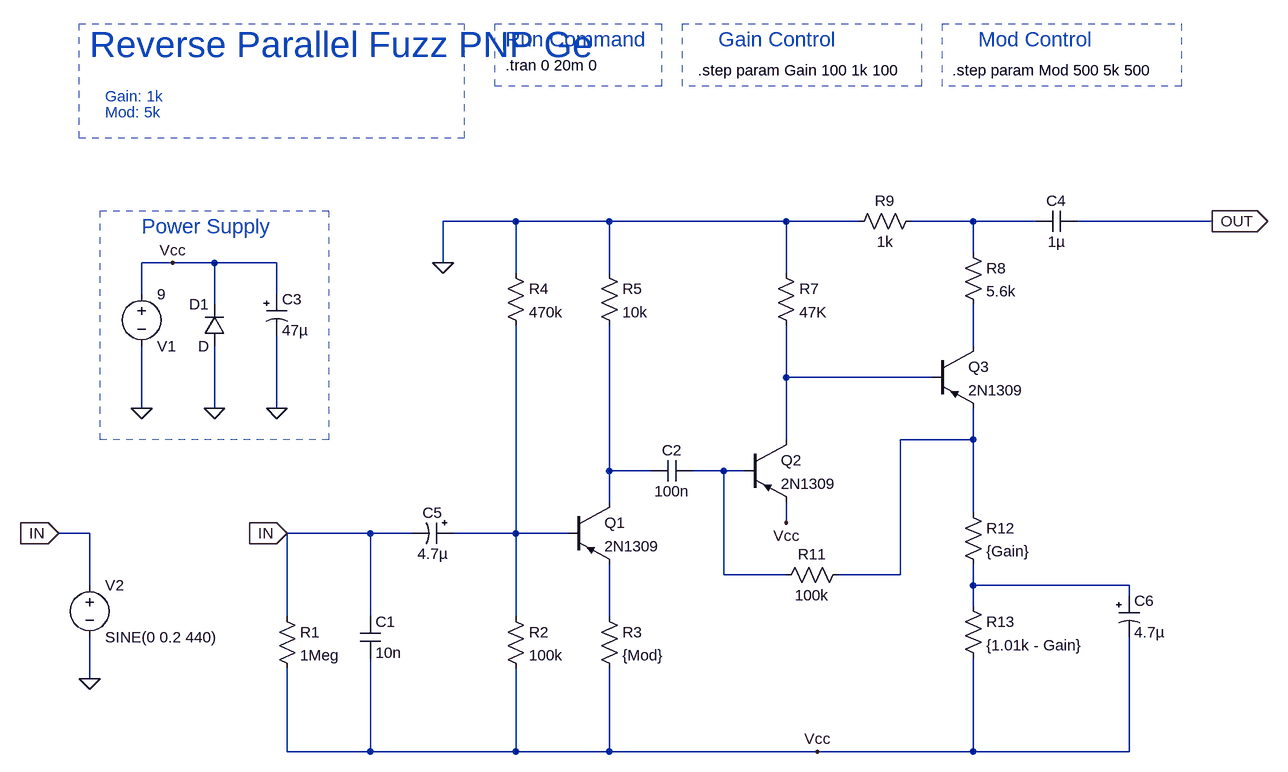
[diagram p0: schematic rp-fuzz-ge.asc]
rp-fuzz-ge.asc, the LTspice schematic file:
Version 4
SHEET 1 2556 1544
WIRE 1312 624 1200 624
WIRE 1456 624 1312 624
WIRE 1728 624 1456 624
WIRE 1840 624 1728 624
WIRE 2016 624 1920 624
WIRE 2112 624 2016 624
WIRE 2384 624 2176 624
WIRE 2016 672 2016 624
WIRE 784 688 736 688
WIRE 848 688 784 688
WIRE 944 688 848 688
WIRE 1200 688 1200 624
WIRE 1312 704 1312 624
WIRE 1456 704 1456 624
WIRE 1728 704 1728 624
WIRE 736 736 736 688
WIRE 944 736 944 688
WIRE 848 752 848 688
WIRE 2016 816 2016 752
WIRE 1728 864 1728 784
WIRE 1952 864 1728 864
WIRE 736 912 736 816
WIRE 848 912 848 816
WIRE 944 912 944 800
WIRE 1728 960 1728 864
WIRE 2016 960 2016 912
WIRE 2016 960 1904 960
WIRE 1456 1008 1456 784
WIRE 1520 1008 1456 1008
WIRE 1632 1008 1584 1008
WIRE 1664 1008 1632 1008
WIRE 1456 1056 1456 1008
WIRE 2016 1072 2016 960
WIRE 1728 1088 1728 1056
WIRE 656 1104 608 1104
WIRE 1088 1104 960 1104
WIRE 1152 1104 1088 1104
WIRE 1312 1104 1312 784
WIRE 1312 1104 1216 1104
WIRE 1392 1104 1312 1104
WIRE 1632 1168 1632 1008
WIRE 1728 1168 1632 1168
WIRE 1904 1168 1904 960
WIRE 1904 1168 1808 1168
WIRE 656 1184 656 1104
WIRE 2016 1184 2016 1152
WIRE 2256 1184 2016 1184
WIRE 2256 1200 2256 1184
WIRE 2016 1216 2016 1184
WIRE 960 1232 960 1104
WIRE 1088 1232 1088 1104
WIRE 1312 1232 1312 1104
WIRE 1456 1232 1456 1152
WIRE 656 1328 656 1264
WIRE 960 1440 960 1312
WIRE 1088 1440 1088 1296
WIRE 1088 1440 960 1440
WIRE 1312 1440 1312 1312
WIRE 1312 1440 1088 1440
WIRE 1456 1440 1456 1312
WIRE 1456 1440 1312 1440
WIRE 1776 1440 1456 1440
WIRE 2016 1440 2016 1296
WIRE 2016 1440 1776 1440
WIRE 2256 1440 2256 1264
WIRE 2256 1440 2016 1440
FLAG 736 912 0
FLAG 2384 624 OUT
IOPIN 2384 624 Out
FLAG 608 1104 IN
IOPIN 608 1104 In
FLAG 944 912 0
FLAG 784 688 Vcc
FLAG 1776 1440 Vcc
FLAG 1728 1088 Vcc
FLAG 1200 688 0
FLAG 656 1328 0
FLAG 960 1104 IN
IOPIN 960 1104 In
FLAG 848 912 0
SYMBOL res 944 1216 R0
SYMATTR InstName R1
SYMATTR Value 1Meg
SYMBOL res 1296 1216 R0
SYMATTR InstName R2
SYMATTR Value 100k
SYMBOL res 1440 1216 R0
SYMATTR InstName R3
SYMATTR Value {Mod}
SYMBOL res 1296 688 R0
SYMATTR InstName R4
SYMATTR Value 470k
SYMBOL res 1440 688 R0
SYMATTR InstName R5
SYMATTR Value 10k
SYMBOL res 1712 688 R0
SYMATTR InstName R7
SYMATTR Value 47K
SYMBOL res 2000 656 R0
SYMATTR InstName R8
SYMATTR Value 5.6k
SYMBOL res 1936 608 R90
WINDOW 0 0 56 VBottom 2
WINDOW 3 32 56 VTop 2
SYMATTR InstName R9
SYMATTR Value 1k
SYMBOL res 1824 1152 R90
WINDOW 0 0 56 VBottom 2
WINDOW 3 32 56 VTop 2
SYMATTR InstName R11
SYMATTR Value 100k
SYMBOL cap 1072 1232 R0
SYMATTR InstName C1
SYMATTR Value 10n
SYMBOL cap 1584 992 R90
WINDOW 0 0 32 VBottom 2
WINDOW 3 32 32 VTop 2
SYMATTR InstName C2
SYMATTR Value 100n
SYMBOL cap 2112 640 R270
WINDOW 0 32 32 VTop 2
WINDOW 3 0 32 VBottom 2
SYMATTR InstName C4
SYMATTR Value 1µ
SYMBOL pnp 1392 1056 R0
SYMATTR InstName Q1
SYMATTR Value 2N1309
SYMBOL pnp 1664 960 R0
SYMATTR InstName Q2
SYMATTR Value 2N1309
SYMBOL pnp 1952 816 R0
SYMATTR InstName Q3
SYMATTR Value 2N1309
SYMBOL polcap 1216 1088 R90
WINDOW 0 0 32 VBottom 2
WINDOW 3 32 32 VTop 2
SYMATTR InstName C5
SYMATTR Value 4.7µ
SYMBOL polcap 2240 1200 R0
SYMATTR InstName C6
SYMATTR Value 4.7µ
SYMBOL res 2000 1056 R0
SYMATTR InstName R12
SYMATTR Value {Gain}
SYMBOL res 2000 1200 R0
SYMATTR InstName R13
SYMATTR Value {1.01k - Gain}
SYMBOL voltage 736 720 R0
WINDOW 0 24 96 Left 2
WINDOW 3 24 16 Left 2
WINDOW 123 0 0 Left 0
WINDOW 39 0 0 Left 0
SYMATTR InstName V1
SYMATTR Value 9
SYMBOL voltage 656 1168 R0
WINDOW 123 0 0 Left 0
WINDOW 39 0 0 Left 0
SYMATTR InstName V2
SYMATTR Value SINE(0 0.2 440)
SYMBOL polcap 928 736 R0
SYMATTR InstName C3
SYMATTR Value 47µ
SYMBOL diode 864 816 R180
WINDOW 0 24 64 Left 2
WINDOW 3 24 0 Left 2
SYMATTR InstName D1
TEXT 1296 384 Left 2 !.tran 0 20m 0
TEXT 1592 392 Left 2 !.step param Gain 100 1k 100
TEXT 656 352 Left 5 ;Reverse Parallel Fuzz PNP Ge
TEXT 1984 392 Left 2 !.step param Mod 500 5k 500
TEXT 1624 344 Left 3 ;Gain Control
TEXT 1296 344 Left 3 ;Run Command
TEXT 736 632 Left 3 ;Power Supply
TEXT 2024 344 Left 3 ;Mod Control
TEXT 680 432 Left 2 ;Gain: 1k
TEXT 680 456 Left 2 ;Mod: 5k
RECTANGLE Normal 1536 416 1280 320 1
RECTANGLE Normal 1936 416 1568 320 1
RECTANGLE Normal 2336 416 1968 320 1
RECTANGLE Normal 1232 496 640 320 1
RECTANGLE Normal 1024 960 672 608 1

The netlist it stands for:
* rp-fuzz-ge.asc
R1 IN Vcc 1Meg
R2 N007 Vcc 100k
R3 N009 Vcc {Mod}
R4 0 N007 470k
R5 0 N005 10k
R7 0 N003 47K
R8 N001 N002 5.6k
R9 N001 0 1k
R11 N004 N006 100k
C1 IN Vcc 10n
C2 N006 N005 100n
C4 N001 OUT 1µ
Q1 N005 N007 N009 0 2N1309
Q2 N003 N006 Vcc 0 2N1309
Q3 N002 N003 N004 0 2N1309
C5 N007 IN 4.7µ
C6 N008 Vcc 4.7µ
R12 N004 N008 {Gain}
R13 N008 Vcc {1.01k - Gain}
V1 Vcc 0 9
V2 IN 0 SINE(0 0.2 440)
C3 Vcc 0 47µ
D1 0 Vcc D
.model D D
.lib standard.dio
.model NPN NPN
.model PNP PNP
.lib standard.bjt
.tran 0 20m 0
.step param Gain 100 1k 100
* Reverse Parallel Fuzz PNP Ge
.step param Mod 500 5k 500
* Gain Control
* Run Command
* Power Supply
* Mod Control
* Gain: 1k
* Mod: 5k
.backanno
.end